# EAGLE schematic x2go_power_v1_panel_template (EAGLE 7.2.0)
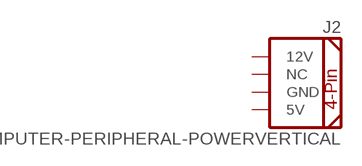
[diagram p0: schematic, sheet 1]

## Parts
J2  COMPUTER-PERIPHERAL-POWERVERTICAL  [COMPUTER-PERIPHERAL-POWER]
Unconnected: J2.5V J2.12V J2.GND J2.NC

## Library data of the parts
J2 = SparkFun-Connectors:COMPUTER-PERIPHERAL-POWER